# Altium schematic sheet Connectors.SchDoc
size 420 x 297 mm; DocumentNumber: Connectors
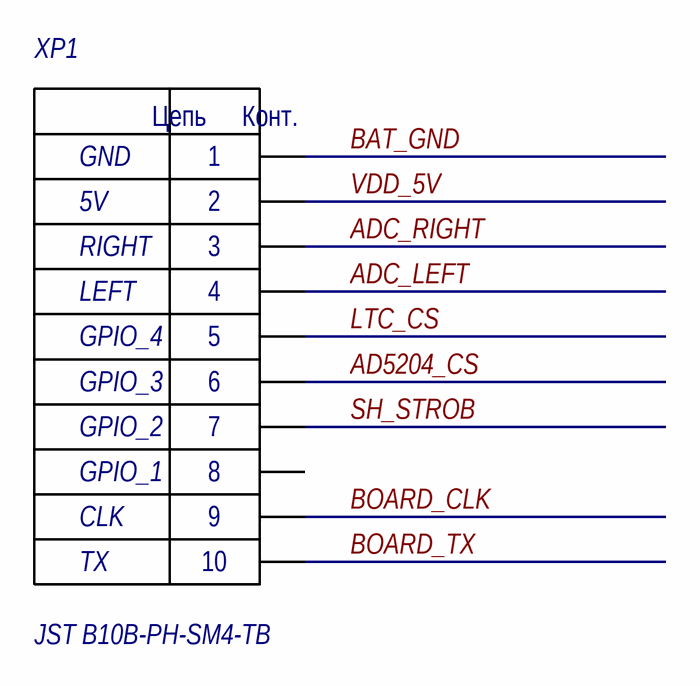
[diagram p0: Connectors.SchDoc]

## Parts
XP1  JST B10B-PH-SM4-TB  [B10B-PH-SM4-TB]

## Nets
AD5204_CS: XP1.6
ADC_LEFT: XP1.4
ADC_RIGHT: XP1.3
BAT_GND: XP1.1
BOARD_CLK: XP1.9
BOARD_TX: XP1.10
LTC_CS: XP1.5
SH_STROB: XP1.7
VDD_5V: XP1.2

Not connected (* = marked no-connect by the designer): XP1 8

## Notes on the sheet
- GND
- RIGHT
- 5V
- GPIO_3
- GPIO_4
- LEFT
- GPIO_1
- GPIO_2
- TX
- CLK
- Подп. и дата
- Инв. № дубл.
- Взам. инв. №
- Инв. № подл.
- Лист
- Изм.
- № докум.
- Подп.
- Дата
- Копировал
- Формат А3
- (in symbol JST B10B-PH-SM4-TB) Цепь; Конт.

## Library data of the parts
XP1 = JST B10B-PH-SM4-TB: PLS connector; Manufacturer: NONAME; Connector type: Вилка на плату; Number of contacts: 10; Type: Разъем штыревой